# Altium project untitled.PrjPcb
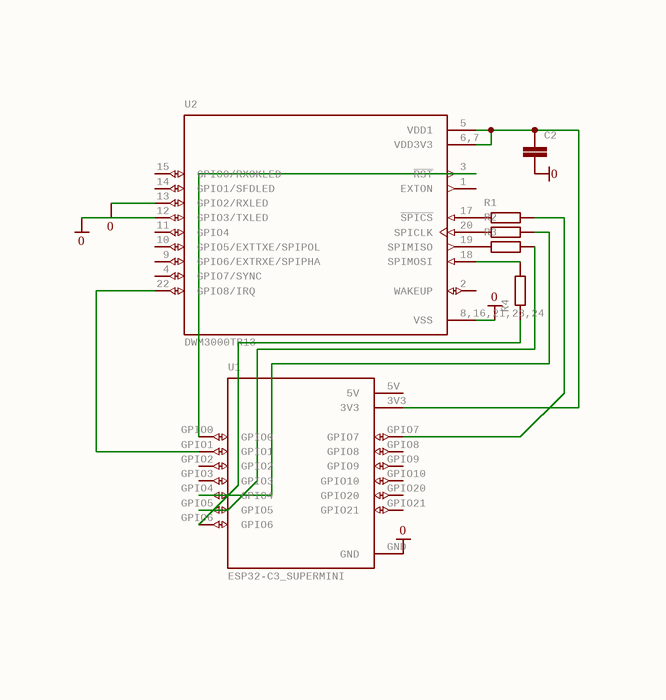
[diagram p0: untitled.SchDoc]
1 sheet, 7 parts. Net scope: global (net labels, ports and power ports of the same name join across sheets).
Board file: untitled.PcbDoc

## Sheet untitled.SchDoc
size 113 x 119 mm; Origin: Eagle

### Parts
C2  C-EUC0402K  [C0402K]  (value not drawn)
R1  SMK  [SMK]  (value not drawn)
R2  SMK  [SMK]  (value not drawn)
R3  SMK  [SMK]  (value not drawn)
R4  SMK  [SMK]  (value not drawn)
U1  ESP32-C3_SUPERMINI  [MODULE_ESP32-C3_SUPERMINI]
U2  DWM3000TR13  [XCVR_DWM3000TR13]

### Nets
0: C2.2 U1.GND U2.8,16,21,23,24(VSS) U2.12(GPIO3/TXLED) U2.13(GPIO2/RXLED)
NetC2_1: C2.1 U1.3V3 U2.5(VDD1) U2.6,7(VDD3V3)
NetR1_1: R1.1 U1.GPIO7
NetR1_2: R1.2 U2.17(~{SPICS})
NetR2_1: R2.1 U1.GPIO4
NetR2_2: R2.2 U2.20(SPICLK)
NetR3_1: R3.1 U1.GPIO5
NetR3_2: R3.2 U2.19(SPIMISO)
NetR4_1: R4.1 U2.18(SPIMOSI)
NetR4_2: R4.2 U1.GPIO6
NetU1_GPIO0: U1.GPIO0 U2.3(~{RST})
NetU1_GPIO1: U1.GPIO1 U2.22(GPIO8/IRQ)

Not connected (* = marked no-connect by the designer): U1 5V GPIO2 GPIO3 GPIO8 GPIO9 GPIO10 GPIO20 GPIO21; U2 1(EXTON) 2(WAKEUP) 4(GPIO7/SYNC) 9(GPIO6/EXTRXE/SPIPHA) 10(GPIO5/EXTTXE/SPIPOL) 11(GPIO4) 14(GPIO1/SFDLED) 15(GPIO0/RXOKLED)

### Library data of the parts
C2 = C-EUC0402K: CAPACITOR, European symbol; GateName_1: G$1; SymbolName_1: C-EU-1; DeviceSetName: C-EU; DeviceName: C0402K; LibraryName: resistor
R1-R4 = SMK: SMD SHUNT RESISTOR; GateName_1: G$1; SymbolName_1: R; POPULARITY: 1; LibraryName: resistor-shunt; DeviceSetName: SMK; MF: MF; MPN: MPN; OC_FARNELL: unknown; OC_NEWARK: unknown
U1 = ESP32-C3_SUPERMINI: Check availability; GateName_1: G$1; MF: Espressif Systems; MP: ESP32-C3 SuperMini; SymbolName_1: ESP32-C3_SUPERMINI; LibraryName: ESP32-C3_SUPERMINI; DeviceSetName: ESP32-C3_SUPERMINI; AVAILABILITY: Not in stock; CHECK_PRICES: https://www.snapeda.com/parts/ESP32-C3%20SuperMini/Espressif+Systems/view-part/?ref=eda; PACKAGE: Package; PRICE: None; SNAPEDA_LINK: https://www.snapeda.com/parts/ESP32-C3%20SuperMini/Espressif+Systems/view-part/?ref=snap
U2 = DWM3000TR13: Check availability; GateName_1: G$1; MF: Qorvo; SymbolName_1: DWM3000TR13; LibraryName: DWM3000TR13; DeviceSetName: DWM3000TR13; AVAILABILITY: In Stock; CHECK_PRICES: https://www.snapeda.com/parts/DWM3000TR13/Qorvo/view-part/?ref=eda; MP: DWM3000TR13; PACKAGE: None; PRICE: None; SNAPEDA_LINK: https://www.snapeda.com/parts/DWM3000TR13/Qorvo/view-part/?ref=snap